# EAGLE schematic Schematics - Remote Monitoring Hardware (EAGLE 8.1.0)
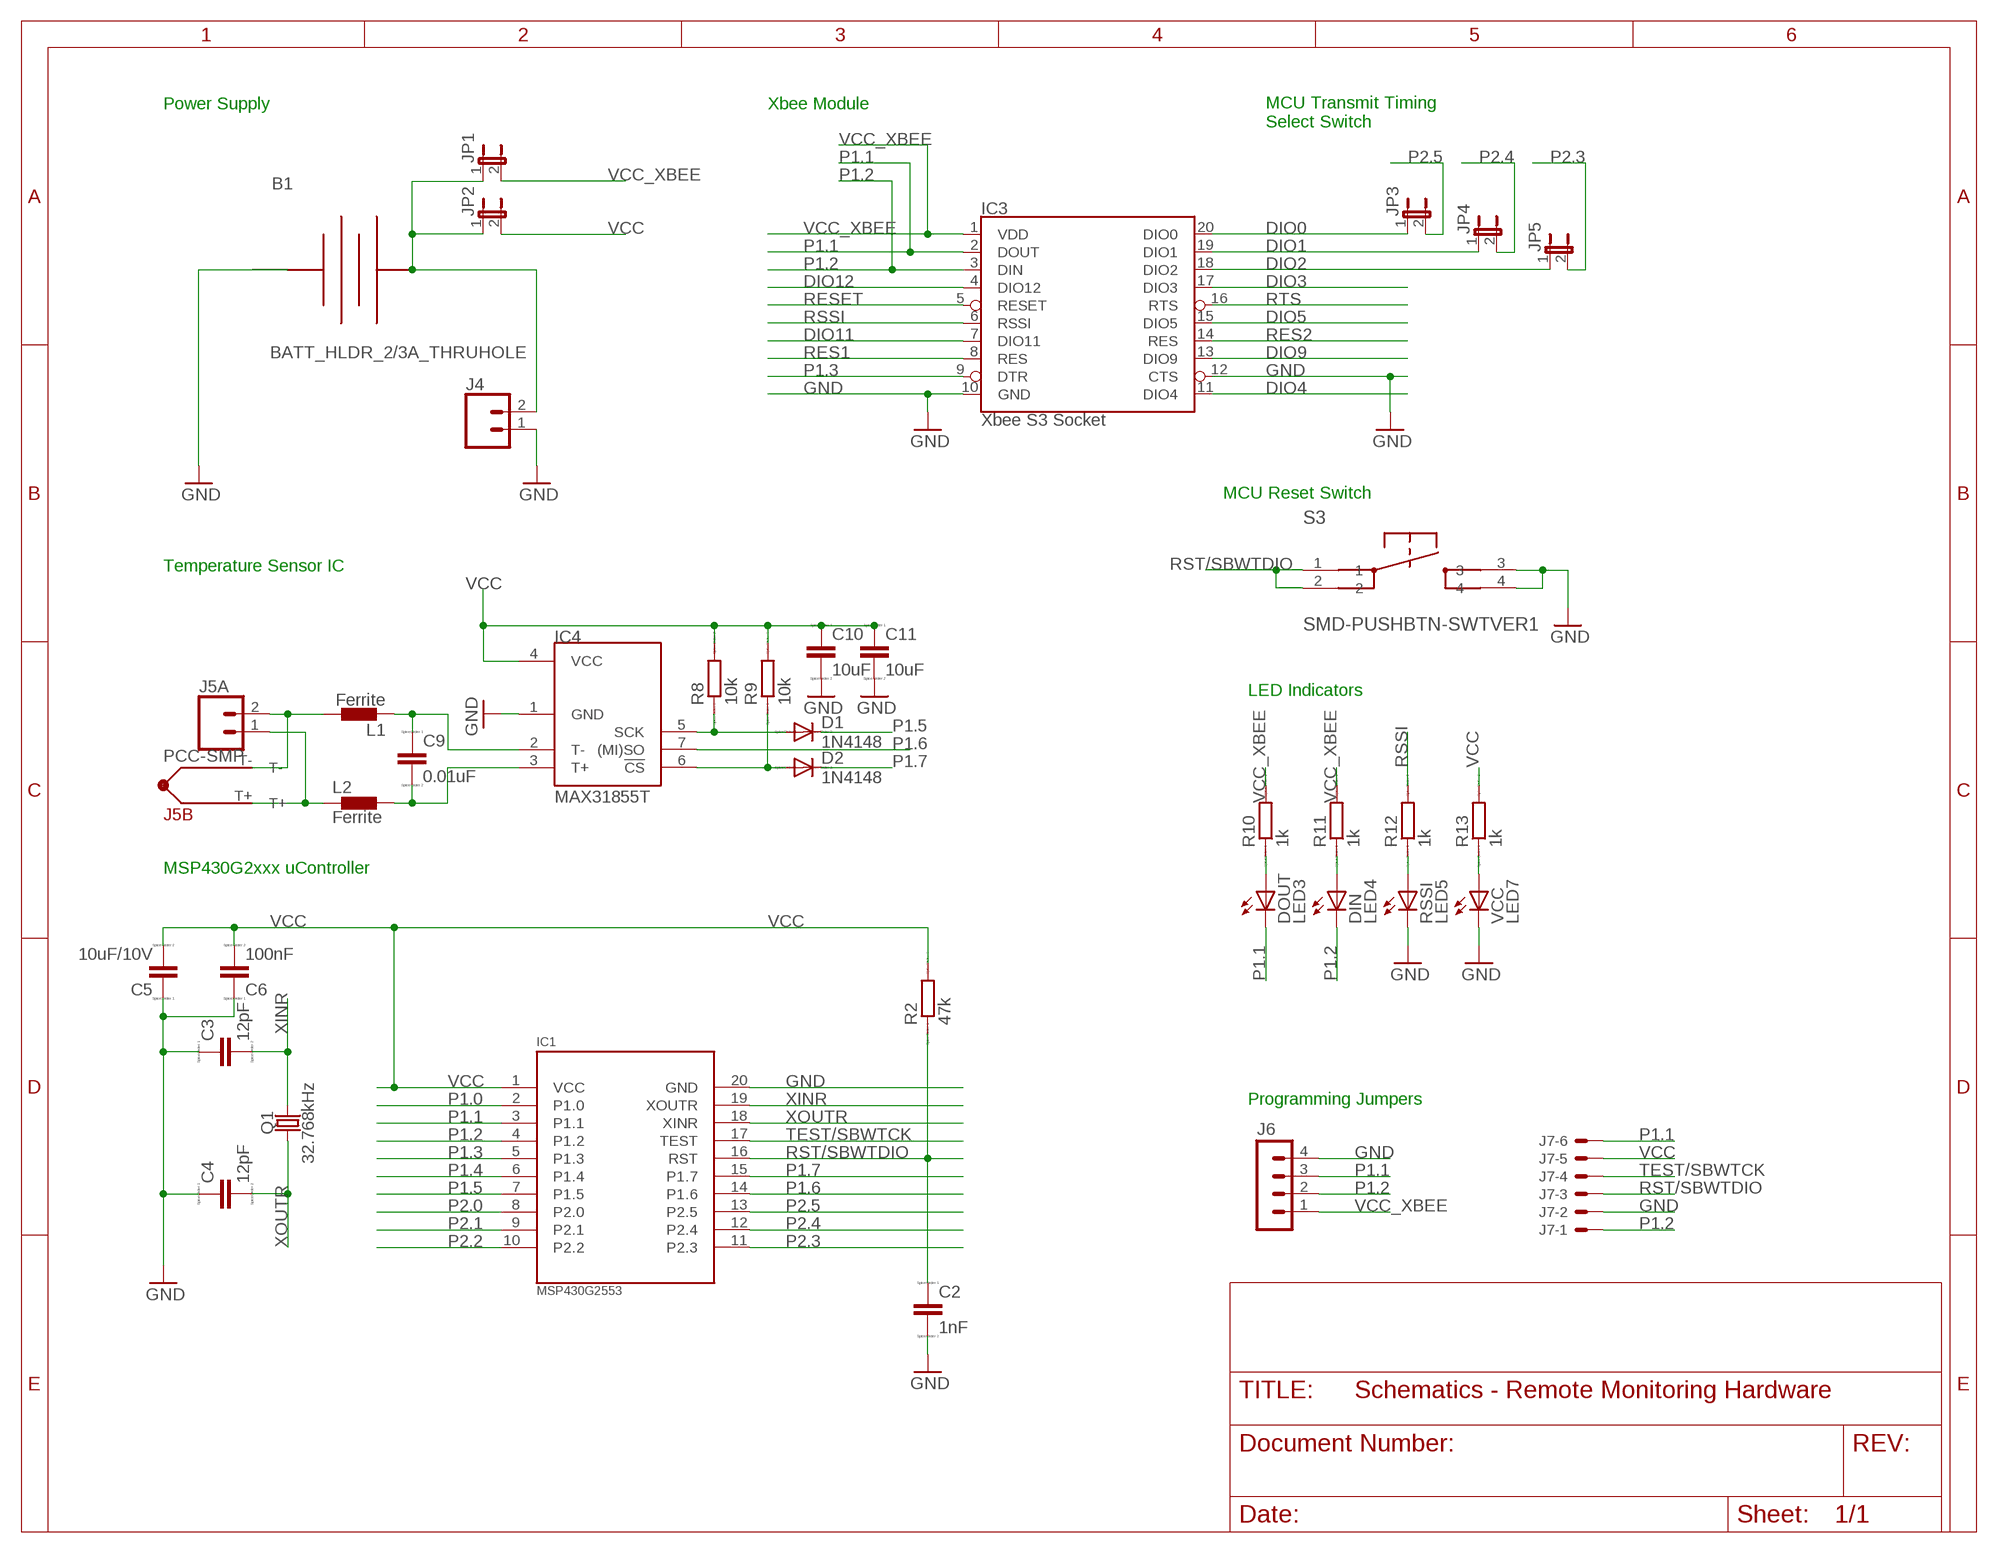
[diagram p0: schematic, sheet 1]

## Parts
B1  BATT_HLDR_2/3A_THRUHOLE  [BATT_HLDR_2/3A_THRUHOLE]
C2  1nF  C  [C0805]
C3  12pF  C  [C0805]
C4  12pF  C  [C0805]
C5  10uF/10V  C  [C0805]
C6  100nF  C  [C0805]
C9  0.01uF  C  [C0805]
C10  10uF  C  [C0805]
C11  10uF  C  [C0805]
D1  1N4148  DIODE-SOD323-R  [SOD323-R]
D2  1N4148  DIODE-SOD323-R  [SOD323-R]
DIN  LED4  LEDSML0805  [SML0805]
DOUT  LED3  LEDSML0805  [SML0805]
IC1  MSP430G2553  MSP430G2553IPW20VER2TSSOP-20  [MSP430G2553IPW20]
IC3  Xbee S3 Socket  XBEELONGPAD  [XBEE-LONGPAD]
IC4  MAX31855T  MAX6675  [SOIC8]
J4  CONN_023.5MM  [SCREWTERMINAL-3.5MM-2]
J5A  CONN_023.5MM  [SCREWTERMINAL-3.5MM-2]
J5B  PCC-SMP  [PCC-SMP]
J6  MA04-1  [MA04-1]
J7  53047-06  [53047-06]
JP1  JUMPER-2PTH  [1X02]
JP2  JUMPER-2PTH  [1X02]
JP3  JUMPER-2PTH  [1X02]
JP4  JUMPER-2PTH  [1X02]
JP5  JUMPER-2PTH  [1X02]
L1  Ferrite  BLM15HB121SN1  [0402]
L2  Ferrite  BLM15HB121SN1  [0402]
Q1  32.768kHz  CRYSTAL-32.768KHZSMD-2X6  [CRYSTAL-SMD-2X6-CYL]
R2  47k  R  [R0805]
R8  10k  R  [R0805]
R9  10k  R  [R0805]
R10  1k  R  [R0805]
R11  1k  R  [R0805]
R12  1k  R  [R0805]
R13  1k  R  [R0805]
RSSI  LED5  LEDSML0805  [SML0805]
S3  SMD-PUSHBTN-SWTVER1  [KPT-1187B]
VCC  LED7  LEDSML0805  [SML0805]

## Nets
1: D1.A IC4.5(SCK) R8.1
2: D2.A IC4.6(!CS) R9.1
DIO0: IC3.20(DIO0) JP3.1
DIO1: IC3.19(DIO1) JP4.1
DIO2: IC3.18(DIO2) JP5.1
DIO3: IC3.17(DIO3)
DIO4: IC3.11(DIO4)
DIO5: IC3.15(DIO5)
DIO9: IC3.13(DIO9)
DIO11: IC3.7(DIO11)
DIO12: IC3.4(DIO12)
GND: B1.NEG C2.2 C3.1 C4.1 C5.1 C6.1 C10.2 C11.2 IC1.20(GND) IC3.10(GND) IC3.12(CTS) IC4.1(GND) J4.1 J6.4 J7.2 RSSI.C S3.3 S3.4 VCC.C
N$1: B1.POS J4.2 JP1.1 JP2.1
N$4: DOUT.A R10.1
N$10: DIN.A R11.1
N$11: R12.1 RSSI.A
N$12: C9.1 IC4.2(T-) L1.1
N$13: C9.2 IC4.3(T+) L2.2
N$14: J5A.2 J5B.T- L1.2
N$15: J5A.1 J5B.T+ L2.1
N$17: R13.1 VCC.A
P1.0: IC1.2(P1.0)
P1.1: DOUT.C IC1.3(P1.1) IC3.2(DOUT) J6.3 J7.6
P1.2: DIN.C IC1.4(P1.2) IC3.3(DIN) J6.2 J7.1
P1.3: IC1.5(P1.3) IC3.9(DTR)
P1.4: IC1.6(P1.4)
P1.5: D1.C IC1.7(P1.5)
P1.6: IC1.14(P1.6) IC4.7((MI)SO)
P1.7: D2.C IC1.15(P1.7)
P2.0: IC1.8(P2.0)
P2.1: IC1.9(P2.1)
P2.2: IC1.10(P2.2)
P2.3: IC1.11(P2.3) JP5.2
P2.4: IC1.12(P2.4) JP4.2
P2.5: IC1.13(P2.5) JP3.2
RES1: IC3.8(RES)
RES2: IC3.14(RES)
RESET: IC3.5(RESET)
RSSI: IC3.6(RSSI) R12.2
RST/SBWTDIO: C2.1 IC1.16(RST) J7.3 R2.1 S3.1 S3.2
RTS: IC3.16(RTS)
TEST/SBWTCK: IC1.17(TEST) J7.4
VCC: C5.2 C6.2 C10.1 C11.1 IC1.1(VCC) IC4.4(VCC) J7.5 JP2.2 R2.2 R8.2 R9.2 R13.2
VCC_XBEE: IC3.1(VDD) J6.1 JP1.2 R10.2 R11.2
XINR: C3.2 IC1.19(XOUTR) Q1.X2
XOUTR: C4.2 IC1.18(XINR) Q1.X1

## Notes on the sheet
- Power Supply | Xbee Module
- MCU Transmit Timing 
  Select Switch
- MCU Reset Switch
- Temperature Sensor IC
- LED Indicators
- MSP430G2xxx uController
- Programming Jumpers

## Library data of the parts
B1 = custom parts:BATT_HLDR_2/3A_THRUHOLE
C2-C6 C9-C11 = eagle-ltspice:C: CAPACITOR, European symbol; SPICEMODEL: NONE; SPICEPREFIX: C
D1 D2 = diode:DIODE-: DIODE
DIN DOUT RSSI VCC = led:LED: LED OSRAM: - CHIPLED LG R971, LG N971, LY N971, LG Q971, LY Q971, LO R971, LY R971 LH N974, LH R974 LS Q976, LO Q976, LY Q976 LO Q996 - Hyper CHIPLED LW Q18S LB Q993, LB Q99A, LB R99A - SideLED LS A670, LO A670, LY A670, LG A670, LP A670 LB A673, LV A673, LT A673, LW A673 LH A674 LY A675 LS A676, LA A676, LO A676, LY A676, LW A676 LS A679, LY A679, LG A679 - Hyper Micro SIDELED® LS Y876, LA Y876, LO Y876, LY Y876 LT Y87S - SmartLED LW L88C, LW L88S LB L89C, LB L89S, LG L890 LS L89K, LO L89K, LY L89K LS L896, LA L896, LO L896, LY L896 - TOPLED LS T670, LO T670, LY T670, LG T670, LP T670 LSG T670, LSP T670, LSY T670, LOP T670, LYG T670 LG T671, LOG T671, LSG T671 LB T673, LV T673, LT T673, LW T673 LH T674 LS T676, LA T676, LO T676, LY T676, LB T676, LH T676, LSB T676, LW T676 LB T67C, LV T67C, LT T67C, LS T67K, LO T67K, LY T67K, LW E67C LS E67B, LA E67B, LO E67B, LY E67B, LB E67C, LV E67C, LT E67C LW T67C LS T679, LY T679, LG T679 LS T770, LO T770, LY T770, LG T770, LP T770 LB T773, LV T773, LT T773, LW T773 LH T774 LS E675, LA E675, LY E675, LS T675 LS T776, LA T776, LO T776, LY T776, LB T776 LHGB T686 LT T68C, LB T68C - Hyper Mini TOPLED® LB M676 - Mini TOPLED Santana® LG M470 LS M47K, LO M47K, LY M47K Source: http://www.osram.convergy.de LUXEON: - LUMILED® LXK2-PW12-R00, LXK2-PW12-S00, LXK2-PW14-U00, LXK2-PW14-V00 LXK2-PM12-R00, LXK2-PM12-S00, LXK2-PM14-U00 LXK2-PE12-Q00, LXK2-PE12-R00, LXK2-PE12-S00, LXK2-PE14-T00, LXK2-PE14-U00 LXK2-PB12-K00, LXK2-PB12-L00, LXK2-PB12-M00, LXK2-PB14-N00, LXK2-PB14-P00, LXK2-PB14-Q00 LXK2-PR12-L00, LXK2-PR12-M00, LXK2-PR14-Q00, LXK2-PR14-R00 LXK2-PD12-Q00, LXK2-PD12-R00, LXK2-PD12-S00 LXK2-PH12-R00, LXK2-PH12-S00 LXK2-PL12-P00, LXK2-PL12-Q00, LXK2-PL12-R00 Source: www.luxeon.com KINGBRIGHT: KA-3528ASYC Source: www.kingbright.com
IC1 = custom parts:MSP430G2553IPW20VER2
IC3 = SparkFun-RF:XBEE: Digi XBee and XBee Pro XBees are tiny blue chips that can communicate wirelessly with each other. They can do simple things, like replacing a couple of wires in serial communication, which is nice when you want to make a remote for your paintball vehicle. SparkFun Products SparkFun XBee Buying Guide <https://www.sparkfun.com/pages/xbee_guide> SparkFun XBee Explorer USB <https://www.sparkfun.com/products/11812> (WRL-11812) Breakout Board for XBee Module <https://www.sparkfun.com/products/8276> (WRL-8276) SparkFun XBee Explorer Regulated <https://www.sparkfun.com/products/11373> (WRL-11373) SparkFun XBee Explorer Dongle <https://www.sparkfun.com/products/11697> (WRL-11697) SparkFun XBee Shield <https://www.sparkfun.com/products/12847> (WRL-12847) SparkFun XBee Explorer Serial <https://www.sparkfun.com/products/13225> (WRL-13225)
IC4 = SparkFun-Retired:MAX6675: Cold-Junction-Compensated K-Thermocoupleto-Digital Converter (0°C to +1024°C) The MAX6675 performs cold-junction compensation and digitizes the signal from a type-K thermocouple. The data is output in a 12-bit resolution, SPI™-compatible, read-only format. This converter resolves temperatures to 0.25°C, allows readings as high as +1024°C, and exhibits thermocouple accuracy of 8LSBs for temperatures ranging from 0°C to +700°C. Dead Prototype: IC-12512; PROD_ID: IC-12512
J4 J5A = SparkFun-Connectors:CONN_02: Multi connection point. Often used as Generic Header-pin footprint for 0.1 inch spaced/style header connections On any of the 0.1 inch spaced packages, you can populate with these: Break Away Headers - Straight <https://www.sparkfun.com/products/116> (PRT-00116) Break Away Male Headers - Right Angle <https://www.sparkfun.com/products/553> (PRT-00553) Female Headers <https://www.sparkfun.com/products/115> (PRT-00115) Break Away Headers - Machine Pin <https://www.sparkfun.com/products/117> (PRT-00117) Break Away Female Headers - Swiss Machine Pin <https://www.sparkfun.com/products/743> (PRT-00743) For SCREWTERMINALS and SPRING TERMINALS visit here: Screw Terimnals on SparkFun.com <https://www.sparkfun.com/search/results?term=Screw+Terminals> (5mm/3.5mm/2.54mm spacing) This device is also useful as a general connection point to wire up your design to another part of your project. Our various solder wires solder well into these plated through hole pads. Hook-Up Wire - Assortment (Stranded, 22 AWG) <https://www.sparkfun.com/products/11375> (PRT-11375) Hook-Up Wire - Assortment (Solid Core, 22 AWG) <https://www.sparkfun.com/products/11367> (PRT-11367) View the entire wire category on our website here <https://www.sparkfun.com/categories/141> Special notes: Molex polarized connector foot print use with: PRT-08233 with associated crimp pins and housings. 2.54_SCREWTERM for use with PRT-10571. 3.5mm Screw Terminal footprints for PRT-08084 5mm Screw Terminal footprints for use with PRT-08432; PROD_ID: CONN-08399
J5B = custom parts:PCC-SMP
J6 = con-lstb:MA04-1: PIN HEADER; OC_FARNELL: unknown; OC_NEWARK: unknown
J7 = con-molex:53?-06: CONNECTOR wire to board 1.25 mm (.049 inch) pitch header; MPN: 53047-0610-C; OC_FARNELL: 9733078; OC_NEWARK: 03M2965
JP1-JP5 = SparkFun-Retired:JUMPER-2: Jumper Basic 0.1" spaced jumper. Use with breakaway headers.
L1 L2 = inductors:BLM15H: EMIFIL (R) Chip Ferrite Bead for GHz Noise Source: http://www.murata.com/ Ferrite Bead BLM15H.pdf
Q1 = SparkFun-Clocks:CRYSTAL-32.768KHZ: 32.768kHz Crystal Frequency: 32.768kHz Frequency Stability: ±20ppm Load Capacitance: 12.5pF (PTH-2X6 & SMD-3.2X1.5), 6pF (SMD-2X6) SparkFun Products: SparkFun BigTime Watch Kit <https://www.sparkfun.com/products/11734> SparkFun nRF52832 Breakout <https://www.sparkfun.com/products/13990> SparkFun Real Time Clock Module <https://www.sparkfun.com/products/12708>; PROD_ID: XTAL-07894
R2 R8-R13 = eagle-ltspice:R: RESISTOR, European symbol; SPICEMODEL: NONE; SPICEPREFIX: R
S3 = custom parts:SMD-PUSHBTN-SWT

## Net classes
0 default: width 0.203 mm, clearance 0.205 mm
1 vcc: width 0.305 mm